# EAGLE design Hub (EAGLE 9.6.2)
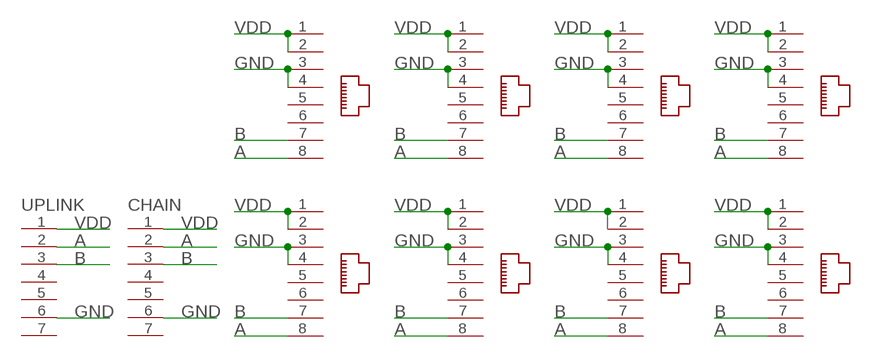
[diagram p0: schematic, sheet 1]

## Parts
1  RJ45-8P8C  [RJ45-8P8C]
2  RJ45-8P8C  [RJ45-8P8C]
3  RJ45-8P8C  [RJ45-8P8C]
4  RJ45-8P8C  [RJ45-8P8C]
5  RJ45-8P8C  [RJ45-8P8C]
6  RJ45-8P8C  [RJ45-8P8C]
7  RJ45-8P8C  [RJ45-8P8C]
8  RJ45-8P8C  [RJ45-8P8C]
CHAIN  GX12-7P  [GX12-7P]
UPLINK  GX12-7P  [GX12-7P]

## Nets
A: 1.8 2.8 3.8 4.8 5.8 6.8 7.8 8.8 CHAIN.2 UPLINK.2
B: 1.7 2.7 3.7 4.7 5.7 6.7 7.7 8.7 CHAIN.3 UPLINK.3
GND: 1.3 1.4 2.3 2.4 3.3 3.4 4.3 4.4 5.3 5.4 6.3 6.4 7.3 7.4 8.3 8.4 CHAIN.6 UPLINK.6
VDD: 1.1 1.2 2.1 2.2 3.1 3.2 4.1 4.2 5.1 5.2 6.1 6.2 7.1 7.2 8.1 8.2 CHAIN.1 UPLINK.1
Unconnected: 1.5 1.6 2.5 2.6 3.5 3.6 4.5 4.6 5.5 5.6 6.5 6.6 7.5 7.6 8.5 8.6 CHAIN.4 CHAIN.5 CHAIN.7 UPLINK.4 UPLINK.5 UPLINK.7

## Library data of the parts
1-8 = A10 Library:RJ45-8P8C: PCB RJ45 8P8C Femlae Jack/Socket Connector 180 degree vertical https://www.aliexpress.com/item/32918645271.html?spm=a2g0o.order_list.0.0.49471802RMJK7Q
CHAIN UPLINK = A10 Library:GX12-7P: GX12 Aviation Connector, 7 pin.

## Net classes
0 default: width 0.406 mm, drill 0.254 mm, clearance 0.152 mm

## Board
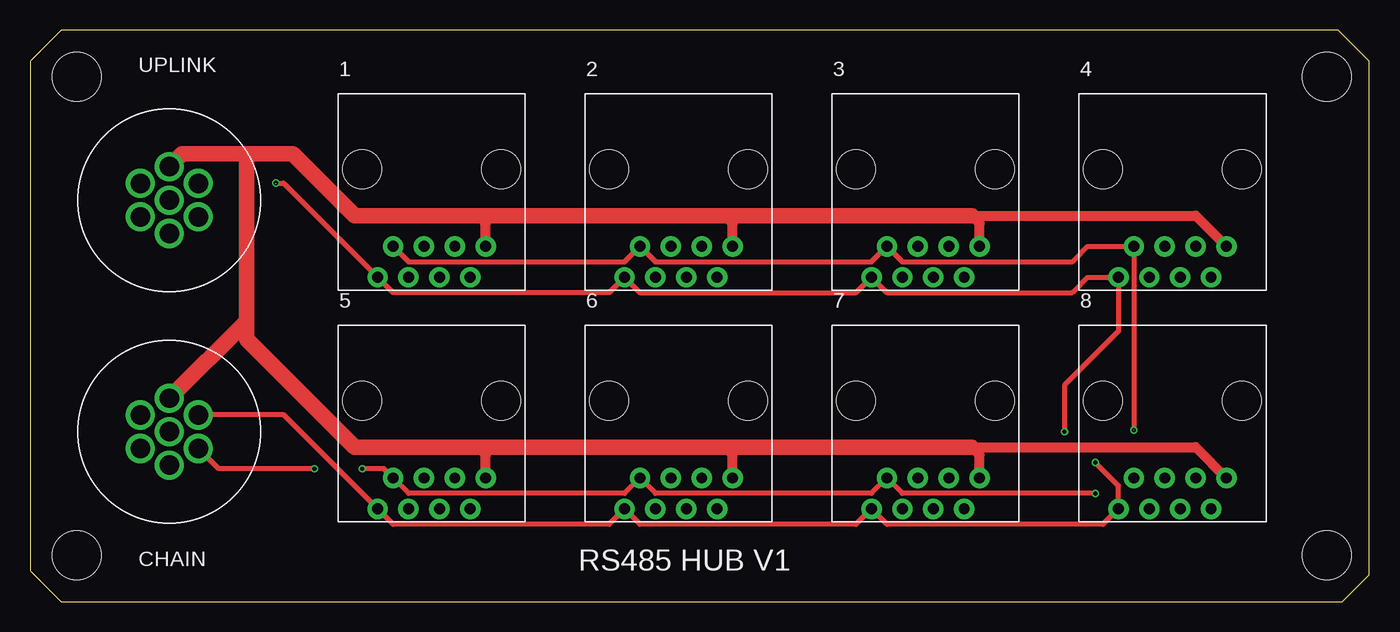
[diagram p1: board, top side]
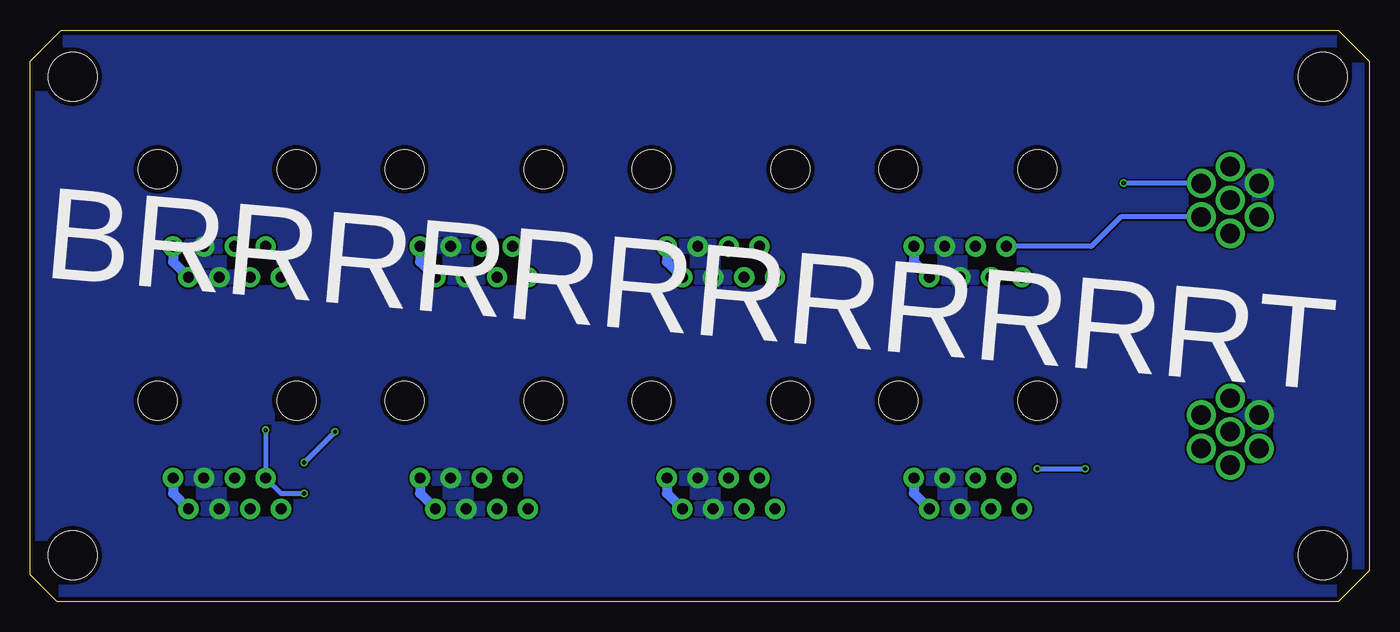
[diagram p2: board, bottom side, seen from below]

Size 110.16 x 46.98 mm. Coordinates in mm from the lower left corner, seen from the top.
Outline: 0,44.45 0,2.54 2.54,0 107.95,0 110.16,2.21 110.16,44.45 107.63,46.98 2.53,46.98 0,44.45
Copper layers (1*16): Top 0.035559375mm / dielectric 1.6mm / Bottom 0.035559375mm
Design rules "oshpark-2layer": minimum track width 6mil, minimum drill 10mil, track to track 6mil, track to pad 6mil, pad to pad 6mil, via to via 6mil, smd to smd 6mil, copper to edge 15mil, drill to drill 6mil, minimum pad ring 5mil, minimum via ring 5mil, stop-mask expansion 2.5mil, vias tented up to drill 0mil, thermal gap 10mil
Holes 4 mm at 3.81,43.18 3.81,3.81 106.68,43.18 106.68,3.81

### Footprints (pad centres in the part's own frame; a part is rotated, then mirrored left to right if it is on the bottom)
RJ45-8P8C = drill 0.9 pad 1.676: 1 4.445,-6.35; 2 3.175,-8.89; 3 1.905,-6.35; 4 0.635,-8.89; 5 -0.635,-6.35; 6 -1.905,-8.89; 7 -3.175,-6.35; 8 -4.445,-8.89 | hole 3.2: -5.715,0; 5.715,0
GX12-7P = drill 1.6 pad 2.184: 1 0,2.75; 2 2.381,1.375; 3 2.381,-1.375; 4 0,-2.75; 5 -2.381,-1.375; 6 -2.381,1.375; 7 0,0

### Placement (x,y rotation side)
1  33.02,35.56 0 top
2  53.34,35.56 0 top
3  73.66,35.56 0 top
4  93.98,35.56 0 top
5  33.02,16.51 0 top
6  53.34,16.51 0 top
7  73.66,16.51 0 top
8  93.98,16.51 0 top
CHAIN  11.43,13.97 0 top
UPLINK  11.43,33.02 0 top

### Tracks (layer width: path | path; a pad name or v marks a point on that pad's centre or on a via)
A  (via drill 0.35)  (1 unrouted)
  Top 0.406: v85.09,13.97 85.09,17.78 89.53,22.23 4.8 87,26.67 85.72,25.4 70.48,25.4 3.8 67.94,25.4 50.16,25.4 2.8 47.62,25.4 29.84,25.4 1.8 20.83,34.42 v20.19,34.42 | v87.63,11.43 89.53,9.53 8.8 88.27,6.35 70.48,6.35 7.8 67.94,6.35 50.16,6.35 6.8 47.62,6.35 29.84,6.35 5.8 20.85,15.35 CHAIN.2
  Bottom 0.406: v85.09,13.97 v87.63,11.43 | UPLINK.2 20.21,34.4
B  (via drill 0.35)  (1 unrouted)
  Top 0.406: 1.7 31.11,27.94 48.9,27.94 2.7 51.44,27.94 69.22,27.94 3.7 71.75,27.94 85.72,27.94 87,29.21 4.7 v90.81,14.11 | v87.63,8.89 71.75,8.89 7.7 69.22,8.89 51.44,8.89 6.7 48.9,8.89 31.11,8.89 5.7 29.08,10.92 v27.3,10.92 | v23.37,10.92 15.48,10.92 CHAIN.3
  Bottom 0.406: UPLINK.3 20.43,31.64 22.86,29.21 1.7 | v90.81,14.1 8.7 89.53,8.89 v87.63,8.89 | v27.3,10.92 v23.37,10.92
GND
  pour Bottom: -1.27,48.26 107.95,48.26 111.76,44.45 111.76,2.54 107.95,-1.27 2.54,-1.27 -1.27,2.54
VDD
  Top 0.838: 1.1 37.47,31.11 36.83,31.75 | 4.1 95.89,31.75 77.47,31.75 78.11,31.11 3.1 | 2.1 57.78,31.11 57.15,31.75 | 5.1 37.47,12.06 36.83,12.7 | 8.1 95.89,12.7 77.47,12.7 78.11,12.06 7.1 | 6.1 57.78,12.06 57.15,12.7
  Top 1.27: UPLINK.1 12.49,36.83 17.78,36.83 | 17.78,36.83 21.59,36.83 26.67,31.75 36.83,31.75 57.15,31.75 77.47,31.75 | CHAIN.1 17.78,23.07 | 17.78,23.07 17.78,36.83 | 17.78,23.07 17.78,21.59 26.67,12.7 36.83,12.7 57.15,12.7 77.47,12.7
  Bottom 0.838: 1.1 37.47,27.94 1.2 | 2.1 57.78,27.94 2.2 | 3.1 78.11,27.94 3.2 | 4.1 98.42,27.94 4.2 | 8.1 98.42,8.89 8.2 | 7.1 78.11,8.89 7.2 | 6.1 57.78,8.89 6.2 | 5.1 37.47,8.89 5.2

### Text on the board
tNames: RS485 HUB V1
bNames: BRRRRRRRRRRRRT